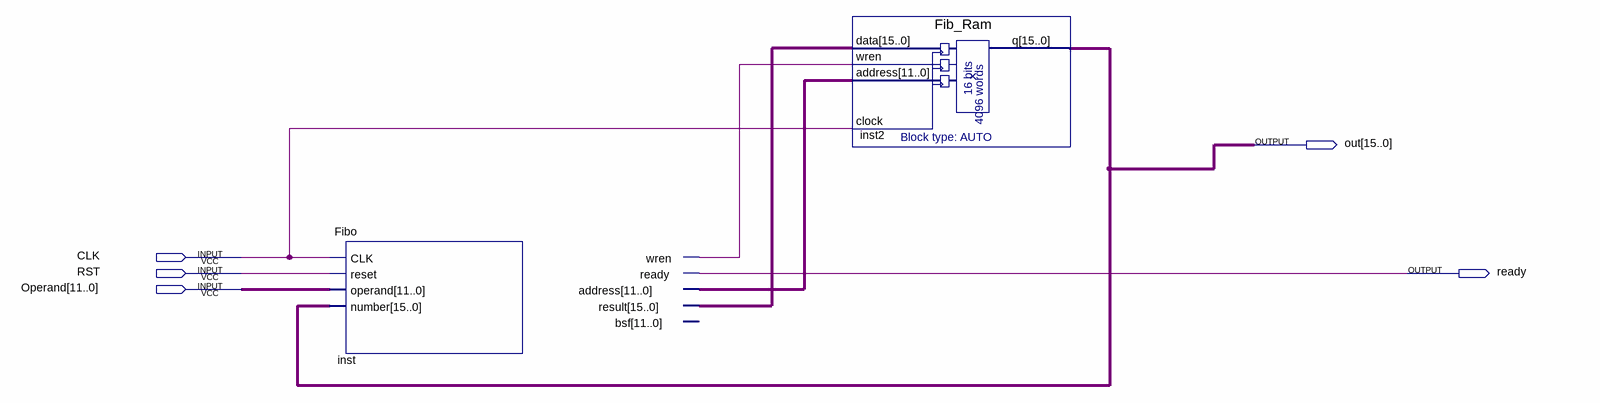
[diagram p0: schematic sheet]
// Quartus schematic Fibo_final.bdf as structural Verilog: 2 symbols, 5 pins
module Fibo_final (
  input  CLK,
  input  RST,
  input  [11:0] Operand,
  output [15:0] out,
  output ready
);

  wire inst_wren;
  wire [11:0] inst_address;
  wire [15:0] inst_result;

  Fibo inst (
    .CLK(CLK), .reset(RST), .operand(Operand), .number(out), .wren(inst_wren), .ready(ready),
    .address(inst_address), .result(inst_result));  // open: bsf
  Fib_Ram inst2 (.data(inst_result), .wren(inst_wren), .address(inst_address), .clock(CLK), .q(out));
endmodule
